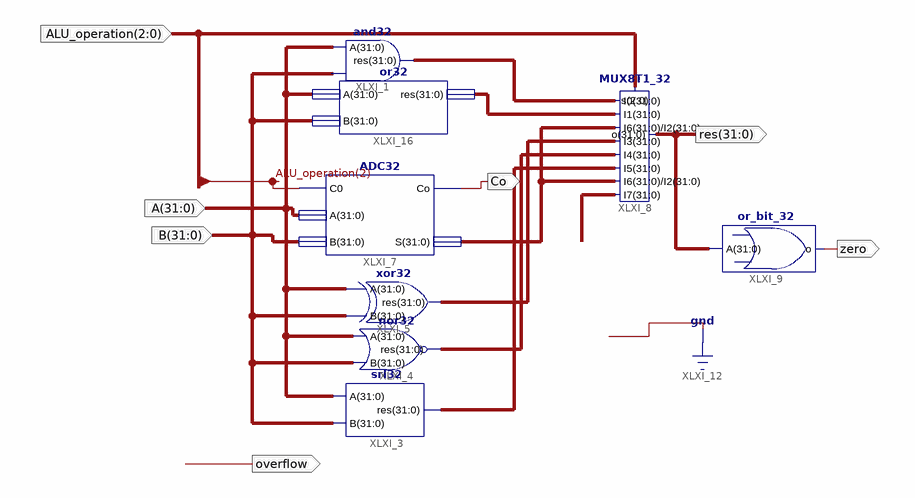
[diagram p0: schematic sheet 1]
// Xilinx ISE schematic ALU.sch (kintex7) as structural Verilog: 8 symbols, 7 ports
module ALU (
  input  [31:0] A,
  input  [31:0] B,
  input  [2:0] ALU_operation,
  output Co,
  output [31:0] res,
  output zero,
  output overflow
);

  wire [31:0] XLXN_15, XLXN_17, XLXN_18, XLXN_19, XLXN_20, XLXN_21;

  and32 XLXI_1 (.res(XLXN_21), .A(A), .B(B));
  srl32 XLXI_3 (.A(A), .B(B), .res(XLXN_19));
  nor32 XLXI_4 (.res(XLXN_18), .A(A), .B(B));
  xor32 XLXI_5 (.A(A), .B(B), .res(XLXN_17));
  ADC32 XLXI_7 (.C0(ALU_operation[2]), .A(A), .B(B), .Co(Co), .S(XLXN_15));
  MUX8T1_32 XLXI_8 (
    .s(ALU_operation), .I7({32{1'b0}}), .I6(XLXN_15), .I5(XLXN_19), .I4(XLXN_18), .I3(XLXN_17), .I2(XLXN_15),
    .I1(XLXN_20), .I0(XLXN_21), .o(res));
  or_bit_32 XLXI_9 (.o(zero), .A(res));
  or32 XLXI_16 (.A(A), .B(B), .res(XLXN_20));
endmodule
